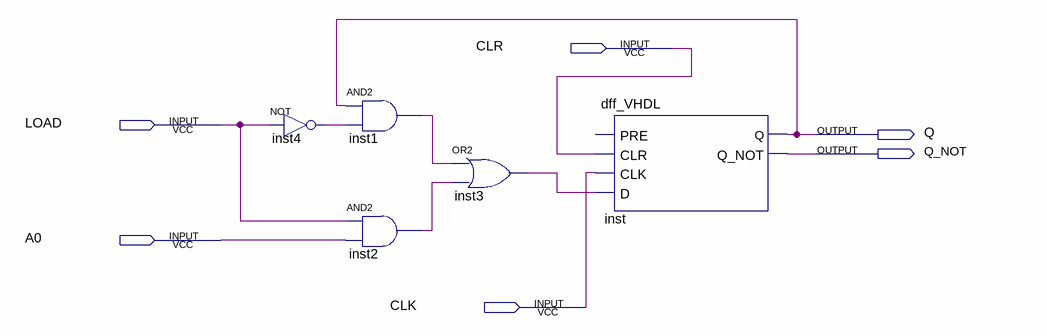
[diagram p0: schematic sheet]
// Quartus schematic Register_1bit.bdf as structural Verilog: 5 symbols, 6 pins
module Register_1bit (
  input  CLR,
  input  LOAD,
  input  A0,
  input  CLK,
  output Q,
  output Q_NOT
);

  wire inst1_out, inst2_out, inst3_out, inst4_out;

  not inst4 (inst4_out, LOAD);
  and inst1 (inst1_out, Q, inst4_out);
  and inst2 (inst2_out, LOAD, A0);
  or inst3 (inst3_out, inst1_out, inst2_out);
  dff_VHDL inst (.CLR(CLR), .CLK(CLK), .D(inst3_out), .Q(Q), .Q_NOT(Q_NOT));  // open: PRE
endmodule
